# EAGLE design smecstim (EAGLE 5.06)
PIN2: ASD - out; PIN3: BARO - in; PIN4: WGAT - in; PIN5: RFAN - in; PIN6: INJ2 - in
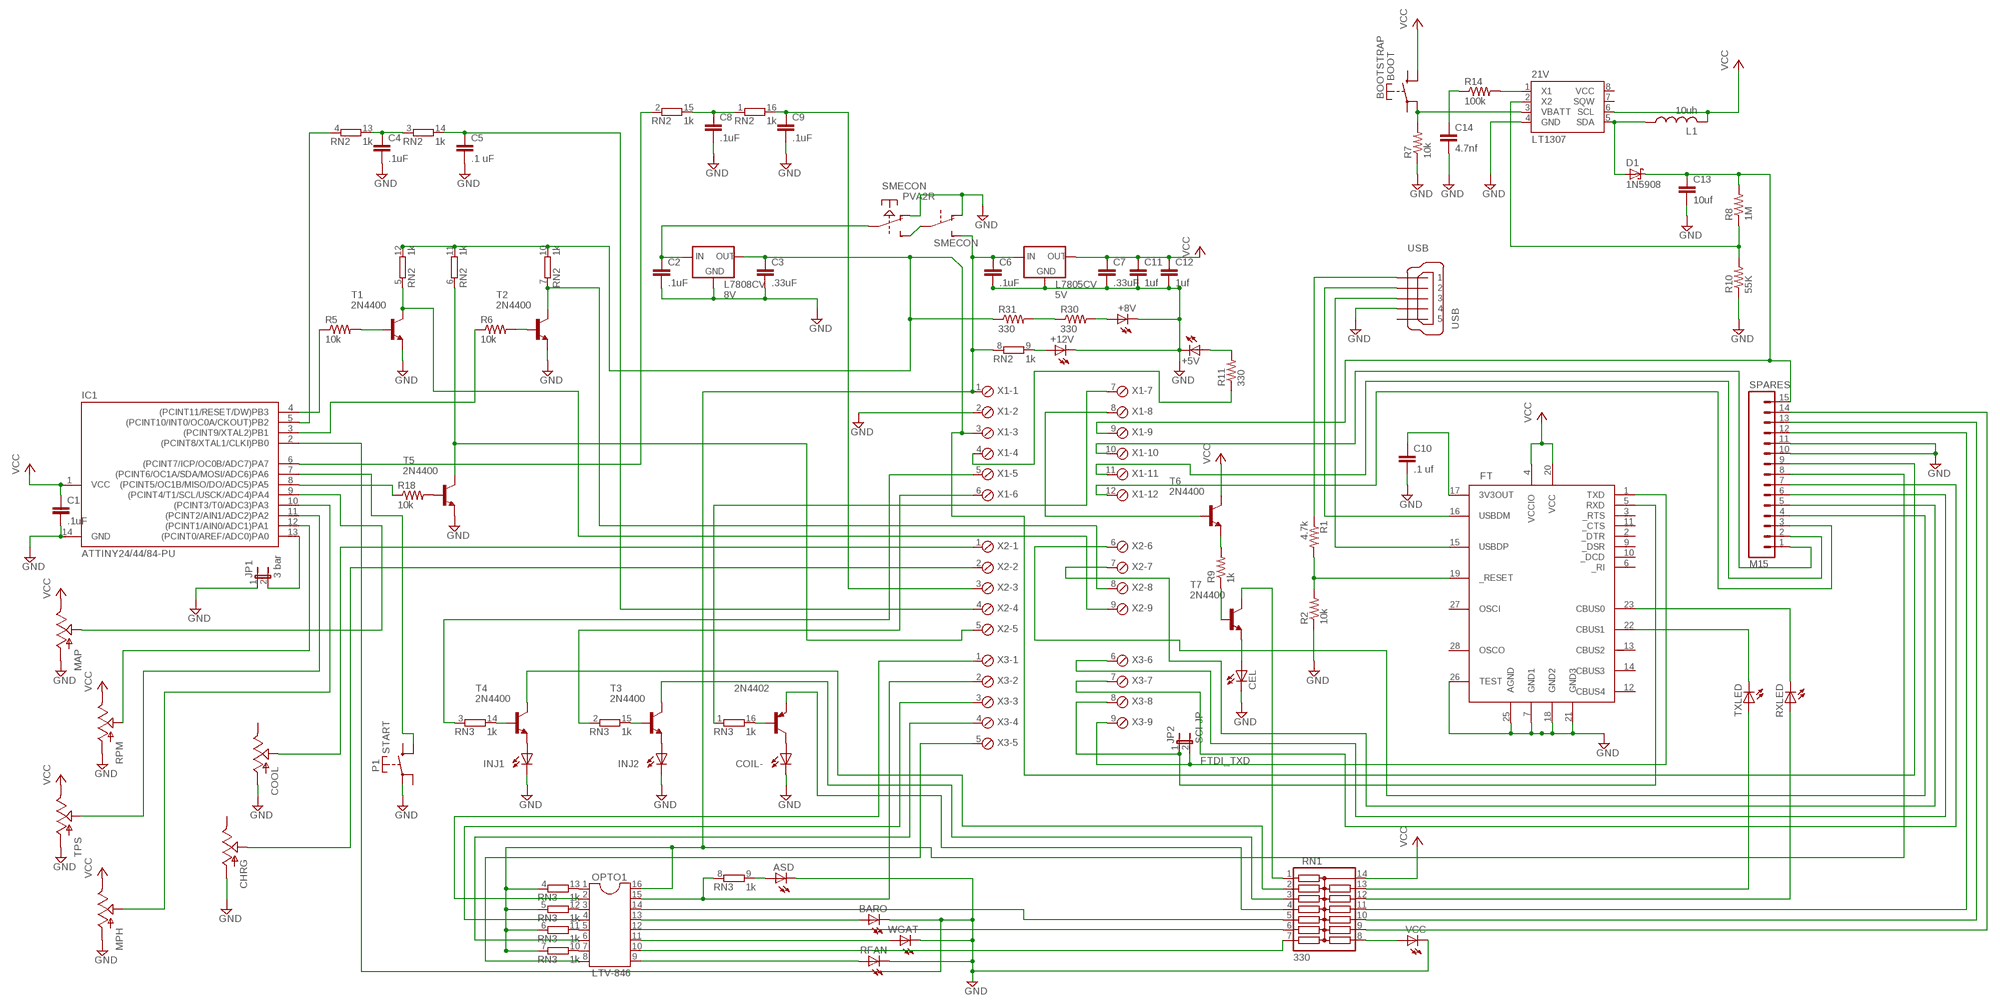
[diagram p0: schematic, sheet 1]

## Parts
2N4402  2N4403-PNP-TO92-EBC  [TO92-EBC]
21V  LT1307  DS1307SO8  [SO08]
+5V  LED5MM  [LED5MM]
+8V  LED5MM  [LED5MM]
+12V  LED5MM  [LED5MM]
ASD  LED5MM  [LED5MM]
BARO  LED5MM  [LED5MM]
BOOTSTRAP  BOOT  FSM4JSMA-SMD  [FSM4JSMA-SMD]
C1  .1uF  C5/2.5  [C5B2.5]
C2  .1uF  C5/2.5  [C5B2.5]
C3  .33uF  C5/2.5  [C5B2.5]
C4  .1uF  C5/2.5  [C5B2.5]
C5  .1 uF  C5/2.5  [C5B2.5]
C6  .1uF  C5/3.5  [C5B3.5]
C7  .33uF  C5/3.5  [C5B3.5]
C8  .1uF  C5/3.5  [C5B3.5]
C9  .1uF  C5/2.5  [C5B2.5]
C10  .1 uf  C5/2.5  [C5B2.5]
C11  1uf  C5/2.5  [C5B2.5]
C12  1uf  C5/2.5  [C5B2.5]
C13  10uf  C5/2.5  [C5B2.5]
C14  4.7nf  C-EU050-030X075  [C050-030X075]
CEL  LED5MM  [LED5MM]
CHRG  CHRG 100K  POT  [ALPS_POT]
COIL-  LED5MM  [LED5MM]
COOL  COOL 100K  POT  [ALPS_POT]
D1  1N5908  [C4111-15]
FT  FT232RL  [SSOP28DB]
IC1  ATTINY24/44/84-PU  [DIL14]
INJ1  LED5MM  [LED5MM]
INJ2  LED5MM  [LED5MM]
JP1  3 bar  JUMPER-2PTH_LOCK  [1X02_LOCK]
JP2  SCI JP  JUMPER-2PTH_LOCK  [1X02_LOCK]
L1  10uh  L-US0207/12  [0207/12]
L7805CV  5V  78XXL  [78XXL]
L7808CV  8V  78XXL  [78XXL]
MAP  MAP 100K  POT  [ALPS_POT]
MPH  MPH 100K  POT  [ALPS_POT]
OPTO1  LTV-846  DIL16S  [SOCKET-16]
P1  START  FSM4JSMA-SMD  [FSM4JSMA-SMD]
R1  4.7k  R-US_0309/12  [0309/12]
R2  10k  R-US_0309/12  [0309/12]
R5  10k  R-US_0309/12  [0309/12]
R6  10k  R-US_0309/12  [0309/12]
R7  10k  R-US_0309/12  [0309/12]
R8  1M  R-US_0309/12  [0309/12]
R9  1k  R-US_0309/12  [0309/12]
R10  55K  R-US_0309/12  [0309/12]
R11  330  R-US_0309/12  [0309/12]
R14  100k  R-US_0309/12  [0309/12]
R18  10k  R-US_0309/12  [0309/12]
R30  330  R-US_0309/12  [0309/12]
R31  330  R-US_0309/12  [0309/12]
RFAN  LED5MM  [LED5MM]
RN1  330  13R  [DIL14]
RN2  1k  8R-P  [DIL16]
RN3  1k  8R-P  [DIL16]
RPM  RPM 100K  POT  [ALPS_POT]
RXLED  LED5MM  [LED5MM]
SMECON  PVA2R  [PVA2R]
SPARES  M15  [1X15]
T1  2N4400  2N4416  [TO92]
T2  2N4400  2N4416  [TO92]
T3  2N4400  2N4416  [TO92]
T4  2N4400  2N4416  [TO92]
T5  2N4400  2N4416  [TO92]
T6  2N4400  2N4416  [TO92]
T7  2N4400  2N4416  [TO92]
TPS  TPS 100K  POT  [ALPS_POT]
TXLED  LED5MM  [LED5MM]
USB  USB  MINI-USB-UX60-MB-5ST  [UX60-MB-5ST]
VCC  LED5MM  [LED5MM]
WGAT  LED5MM  [LED5MM]
X1  MPT12  [12POL254]
X2  MPT9  [9POL254]
X3  MPT9  [9POL254]

## Nets
FTDI_TXD: FT.1(TXD) JP2.2 X3.9
GND: 21V.4(GND) +5V.K(C) +8V.K(C) +12V.K(C) ASD.K(C) BARO.K(C) C1.2 C2.2 C3.2 C4.2 C5.2 C6.2 C7.2 C8.2 C9.2 C10.2 C11.2 C12.2 C13.2 C14.2 CEL.K(C) CHRG.P$3(A) COIL-.K(C) COOL.P$3(A) FT.7(GND1) FT.18(GND2) FT.21(GND3) FT.25(AGND) FT.26(TEST) IC1.2((PCINT8/XTAL1/CLKI)PB0) IC1.14(GND) INJ1.K(C) INJ2.K(C) JP1.1 L7805CV.GND L7808CV.GND MAP.P$3(A) MPH.P$3(A) P1.P$1(P) R2.1 R7.1 R10.1 RFAN.K(C) RPM.P$3(A) SMECON.3(1:O) SMECON.6(2:O) SPARES.10 SPARES.11 T1.3(E) T2.3(E) T5.3(E) TPS.P$3(A) USB.4 VCC.K(C) WGAT.K(C) X1.2
N$1: IC1.10((PCINT3/T0/ADC3)PA3) MPH.P$2(S)
N$2: COOL.P$2(S) X2.1
N$3: OPTO1.2 X3.1
N$4: C3.1 L7808CV.OUT R31.1 RN2.10 RN2.11 RN2.12 SPARES.9 X1.3
N$5: C8.1 RN2.1 RN2.15
N$6: C5.1 RN2.14 X2.4
N$7: CHRG.P$2(S) X2.2
N$8: C9.1 RN2.16 X2.3
N$9: C4.1 RN2.3 RN2.13
N$10: IC1.9((PCINT4/T1/SCL/USCK/ADC4)PA4) MAP.P$2(S)
N$11: IC1.12((PCINT1/AIN0/ADC1)PA1) RPM.P$2(S)
N$12: IC1.11((PCINT2/AIN1/ADC2)PA2) TPS.P$2(S)
N$13: IC1.4((PCINT11/RESET/DW)PB3) R5.1
N$14: IC1.3((PCINT9/XTAL2)PB1) R6.1
N$15: R6.2 T2.2(B)
N$16: R5.2 T1.2(B)
N$17: RN2.5 T1.1(C) X2.9
N$18: RN2.7 T2.1(C) X2.8
N$19: RN3.14 T4.2(B)
N$20: RN3.15 T3.2(B)
N$21: RN1.3 T3.1(C)
N$22: RN1.2 T4.1(C)
N$23: RN3.3 X1.5
N$24: RN3.2 X1.6
N$25: INJ1.A T4.3(E)
N$26: INJ2.A T3.3(E)
N$27: OPTO1.1 RN3.13
N$28: OPTO1.3 RN3.12
N$29: OPTO1.5 RN3.11
N$30: OPTO1.7 RN3.10
N$31: OPTO1.15 RN3.8 X3.2
N$32: 2N4402.B RN3.16
N$33: OPTO1.8 X3.5
N$34: C6.1 L7805CV.IN OPTO1.16 RN2.8 RN3.4 RN3.5 RN3.6 RN3.7 SMECON.4(2:S) SPARES.8 X1.1
N$35: OPTO1.4 X3.3
N$36: OPTO1.6 X3.4
N$37: OPTO1.12 RN1.6
N$38: +5V.A R11.2
N$39: OPTO1.9 RFAN.A
N$40: OPTO1.11 WGAT.A
N$41: ASD.A RN3.9
N$42: OPTO1.10 RN1.7
N$43: BARO.A OPTO1.13
N$44: RN3.1 X1.7
N$45: 2N4402.E RN1.4
N$46: 2N4402.C COIL-.A
N$47: FT.19(_RESET) R1.2 R2.2
N$48: FT.16(USBDM) USB.2
N$49: +12V.A RN2.9
N$50: R30.1 R31.2
N$51: +8V.A R30.2
N$52: R11.1 X1.4
N$53: RN1.1 T7.1(C)
N$54: IC1.5((PCINT10/INT0/OC0A/CKOUT)PB2) RN2.4
N$55: IC1.6((PCINT7/ICP/OC0B/ADC7)PA7) RN2.2
N$56: IC1.8((PCINT5/OC1B/MISO/DO/ADC5)PA5) R18.1
N$57: R18.2 T5.2(B)
N$58: RN2.6 T5.1(C) X2.5
N$59: IC1.7((PCINT6/OC1A/SDA/MOSI/ADC6)PA6) P1.P$4(S)
N$60: IC1.13((PCINT0/AREF/ADC0)PA0) JP1.2
N$61: CEL.A T7.3(E)
N$62: FT.15(USBDP) USB.3
N$63: R1.1 USB.1
N$64: RN1.12 RXLED.A
N$65: C10.1 FT.17(3V3OUT)
N$66: FT.22(CBUS1) TXLED.K(C)
N$67: FT.23(CBUS0) RXLED.K(C)
N$68: RN1.9 SPARES.14
N$69: 21V.5(SDA) D1.A L1.1
N$70: C13.1 D1.C R8.2 SPARES.15 X1.9
N$71: 21V.3(VBATT) BOOTSTRAP.P$2(P) R7.2
N$72: 21V.2(X2) R8.1 R10.2
N$73: 21V.1(X1) R14.2
N$74: C14.1 R14.1
N$75: FT.5(RXD) JP2.1 X3.8
N$76: T6.2(B) X1.8
N$77: R9.2 T6.3(E)
N$78: R9.1 T7.2(B)
N$79: RN1.8 VCC.A
N$80: OPTO1.14 RN1.5
N$81: RN1.13 TXLED.A
N$82: RN1.10 SPARES.13
N$83: RN1.11 SPARES.12
N$84: C2.1 L7808CV.IN SMECON.2(1:P)
N$85: SMECON.1(1:S) SMECON.5(2:P)
SPARE1: SPARES.1 X1.10
SPARE2: SPARES.2 X1.11
SPARE3: SPARES.3 X1.12
SPARE4: SPARES.4 X2.6
SPARE5: SPARES.5 X2.7
SPARE6: SPARES.6 X3.6
SPARE7: SPARES.7 X3.7
VCC: 21V.6(SCL) BOOTSTRAP.P$4(S) C1.1 C7.1 C11.1 C12.1 FT.4(VCCIO) FT.20(VCC) IC1.1(VCC) L1.2 L7805CV.OUT MAP.P$1(E) MPH.P$1(E) RN1.14 RPM.P$1(E) T6.1(C) TPS.P$1(E)
Unconnected: 21V.7(SQW) 21V.8(VCC) BOOTSTRAP.P$1(P) BOOTSTRAP.P$3(S) CHRG.P$1(E) COOL.P$1(E) FT.2(_DTR) FT.3(_RTS) FT.6(_RI) FT.9(_DSR) FT.10(_DCD) FT.11(_CTS) FT.12(CBUS4) FT.13(CBUS2) FT.14(CBUS3) FT.27(OSCI) FT.28(OSCO) P1.P$2(P) P1.P$3(S) USB.5

## Library data of the parts
2N4402 = transistor-neu-to92:*-PNP-: PNP Transistror
21V = SparkFun:DS1307
+5V +8V +12V ASD BARO COIL- INJ1 INJ2 RFAN VCC WGAT = led:LED: LED OSRAM: - CHIPLED LG R971, LG N971, LY N971, LG Q971, LY Q971, LO R971, LY R971 LH N974, LH R974 LS Q976, LO Q976, LY Q976 LO Q996 - Hyper CHIPLED LW Q18S LB Q993, LB Q99A, LB R99A - SideLED LS A670, LO A670, LY A670, LG A670, LP A670 LB A673, LV A673, LT A673, LW A673 LH A674 LY A675 LS A676, LA A676, LO A676, LY A676, LW A676 LS A679, LY A679, LG A679 - Hyper Micro SIDELED® LS Y876, LA Y876, LO Y876, LY Y876 LT Y87S - SmartLED LW L88C, LW L88S LB L89C, LB L89S, LG L890 LS L89K, LO L89K, LY L89K LS L896, LA L896, LO L896, LY L896 - TOPLED LS T670, LO T670, LY T670, LG T670, LP T670 LSG T670, LSP T670, LSY T670, LOP T670, LYG T670 LG T671, LOG T671, LSG T671 LB T673, LV T673, LT T673, LW T673 LH T674 LS T676, LA T676, LO T676, LY T676, LB T676, LH T676, LSB T676, LW T676 LB T67C, LV T67C, LT T67C, LS T67K, LO T67K, LY T67K, LW E67C LS E67B, LA E67B, LO E67B, LY E67B, LB E67C, LV E67C, LT E67C LW T67C LS T679, LY T679, LG T679 LS T770, LO T770, LY T770, LG T770, LP T770 LB T773, LV T773, LT T773, LW T773 LH T774 LS E675, LA E675, LY E675, LS T675 LS T776, LA T776, LO T776, LY T776, LB T776 LHGB T686 LT T68C, LB T68C - Hyper Mini TOPLED® LB M676 - Mini TOPLED Santana® LG M470 LS M47K, LO M47K, LY M47K Source: http://www.osram.convergy.de LUXEON: - LUMILED® LXK2-PW12-R00, LXK2-PW12-S00, LXK2-PW14-U00, LXK2-PW14-V00 LXK2-PM12-R00, LXK2-PM12-S00, LXK2-PM14-U00 LXK2-PE12-Q00, LXK2-PE12-R00, LXK2-PE12-S00, LXK2-PE14-T00, LXK2-PE14-U00 LXK2-PB12-K00, LXK2-PB12-L00, LXK2-PB12-M00, LXK2-PB14-N00, LXK2-PB14-P00, LXK2-PB14-Q00 LXK2-PR12-L00, LXK2-PR12-M00, LXK2-PR14-Q00, LXK2-PR14-R00 LXK2-PD12-Q00, LXK2-PD12-R00, LXK2-PD12-S00 LXK2-PH12-R00, LXK2-PH12-S00 LXK2-PL12-P00, LXK2-PL12-Q00, LXK2-PL12-R00 Source: www.luxeon.com KINGBRIGHT: KA-3528ASYC Source: www.kingbright.com
BOOTSTRAP P1 = switch-misc:FSM4JSMA-SMD: TYCO SWITCH
C1-C13 = capacitor-wima:C: CAPACITOR naming: grid - package width
C14 = rcl:C-EU: CAPACITOR, European symbol
CEL RXLED TXLED = SparkFun:LED: LEDs Standard schematic elements and footprints for 5mm, 3mm, 1206, and 0603 sized LEDs. 5mm - Spark Fun Electronics SKU : COM-00529 (and others)
CHRG COOL MAP MPH RPM TPS = SparkFun:POT
D1 = diode:1N5908: DIODE schottky
FT = ftdichip:FT232RL: USB UART 4th Generation USB UART (USB <-> Serial) Controller
IC1 = attiny24_44_84:ATTINY24/44/84
JP1 JP2 = SparkFun:JUMPER-2: Jumper Basic 0.1" spaced jumper. Use with breakaway headers.
L1 = resistor:L-US: INDUCTOR, American symbol
L7805CV L7808CV = v-reg:78XXL: VOLTAGE REGULATOR
OPTO1 = ic-package:DIL16: Dual In Line / Socket
R1 R2 R7-R11 R14 = rcl:R-US_: RESISTOR, American symbol
R5 R6 R18 R30 R31 = resistor:R-US_: RESISTOR, American symbol
RN1 = resistor-dil:13R: DIL RESISTOR
RN2 RN3 = resistor-dil:8R-P: DIL RESISTOR
SMECON = switch-misc:PVA2R: ITT SWITCH
SPARES = SparkFun:M15: Header 15 Standard 15-pin 0.1" header. Use with straight break away headers (SKU : PRT-00116), right angle break away headers (PRT-00553), swiss pins (PRT-00743), machine pins (PRT-00117), and female headers (PRT-00115).
T1-T4 T6 T7 = transistor:2N4416: NPN TRANSISTOR
T5 = transistor-neu-to92:2N4416: NPN TRANSISTOR
USB = con-hirose:MINI-USB-: MINI USB Connector Source: http://www.hirose.co.jp/cataloge_hp/e24000019.pdf
X1 = con-phoenix-254:MPT12: PHOENIX CONNECTOR
X2 X3 = con-phoenix-254:MPT9: PHOENIX CONNECTOR

## Board
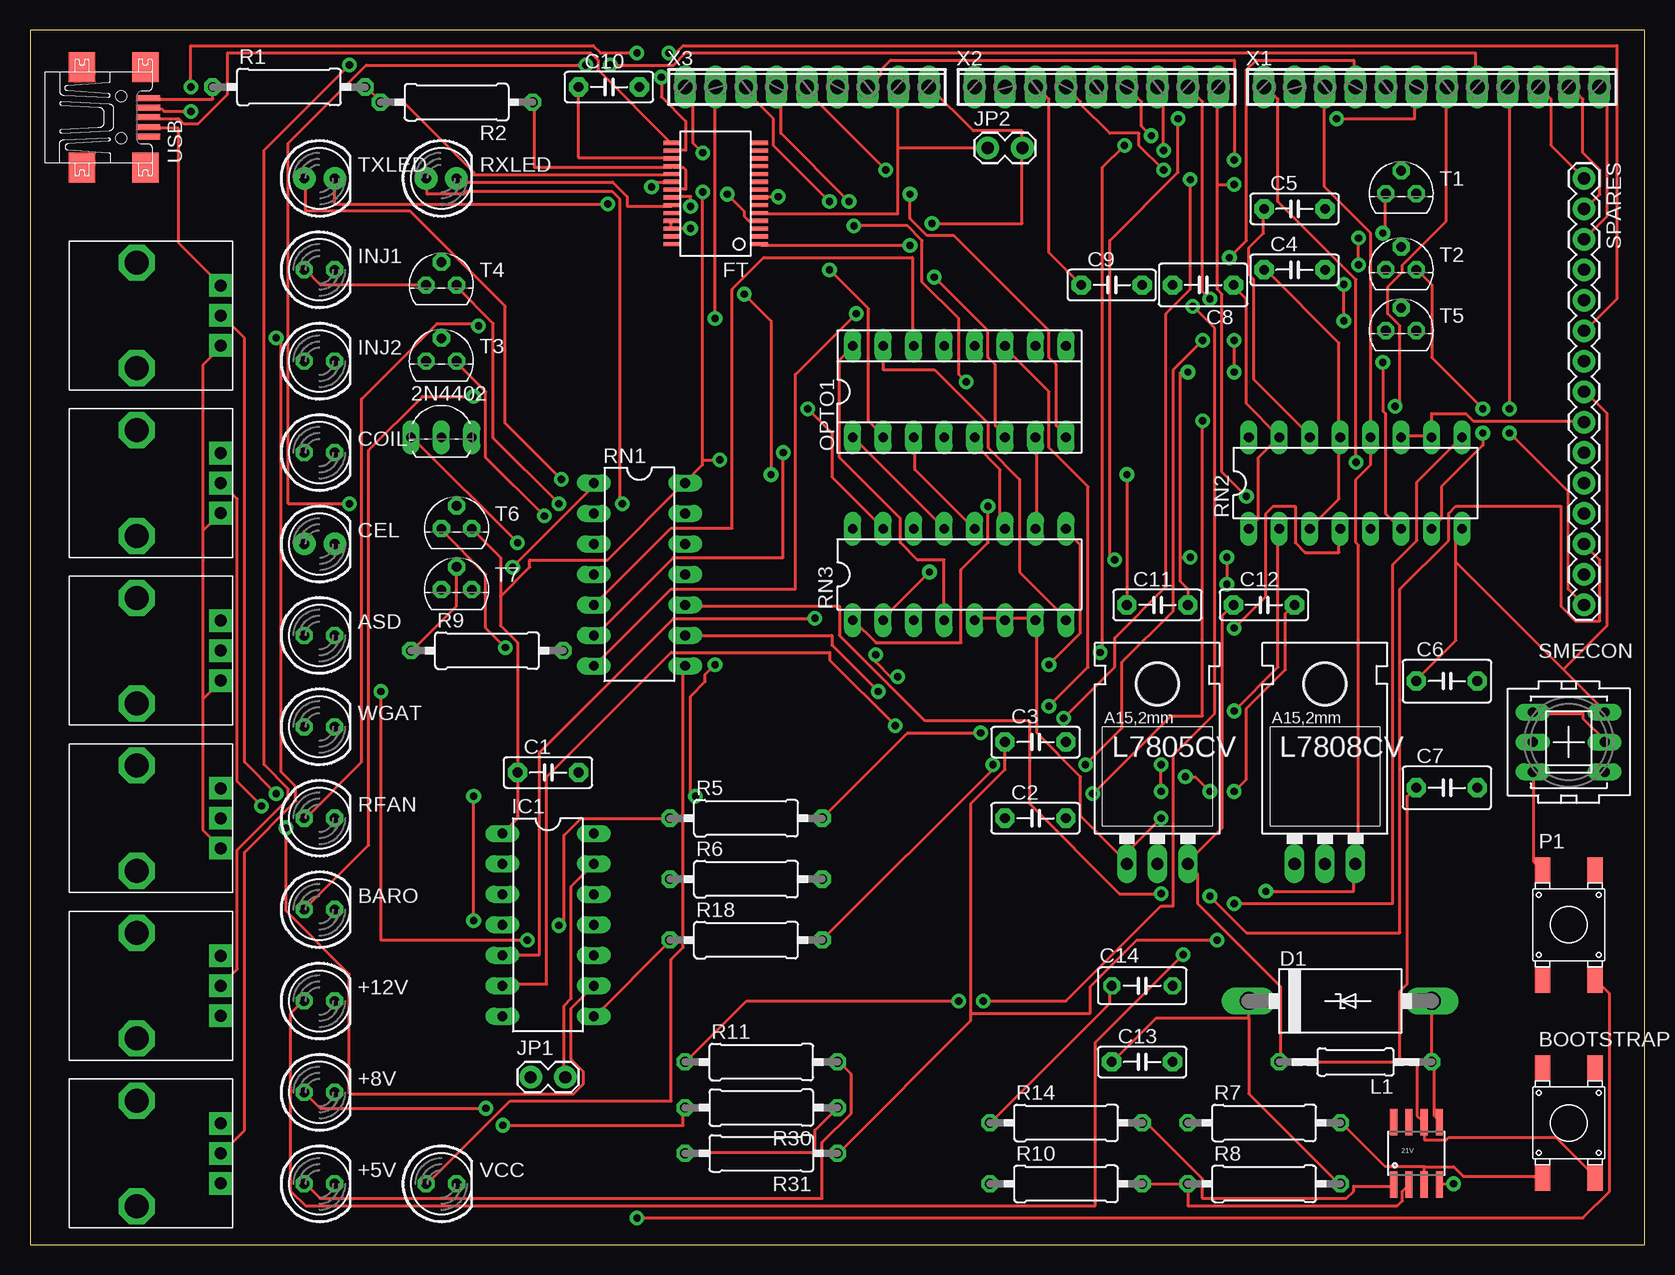
[diagram p1: board, top side]
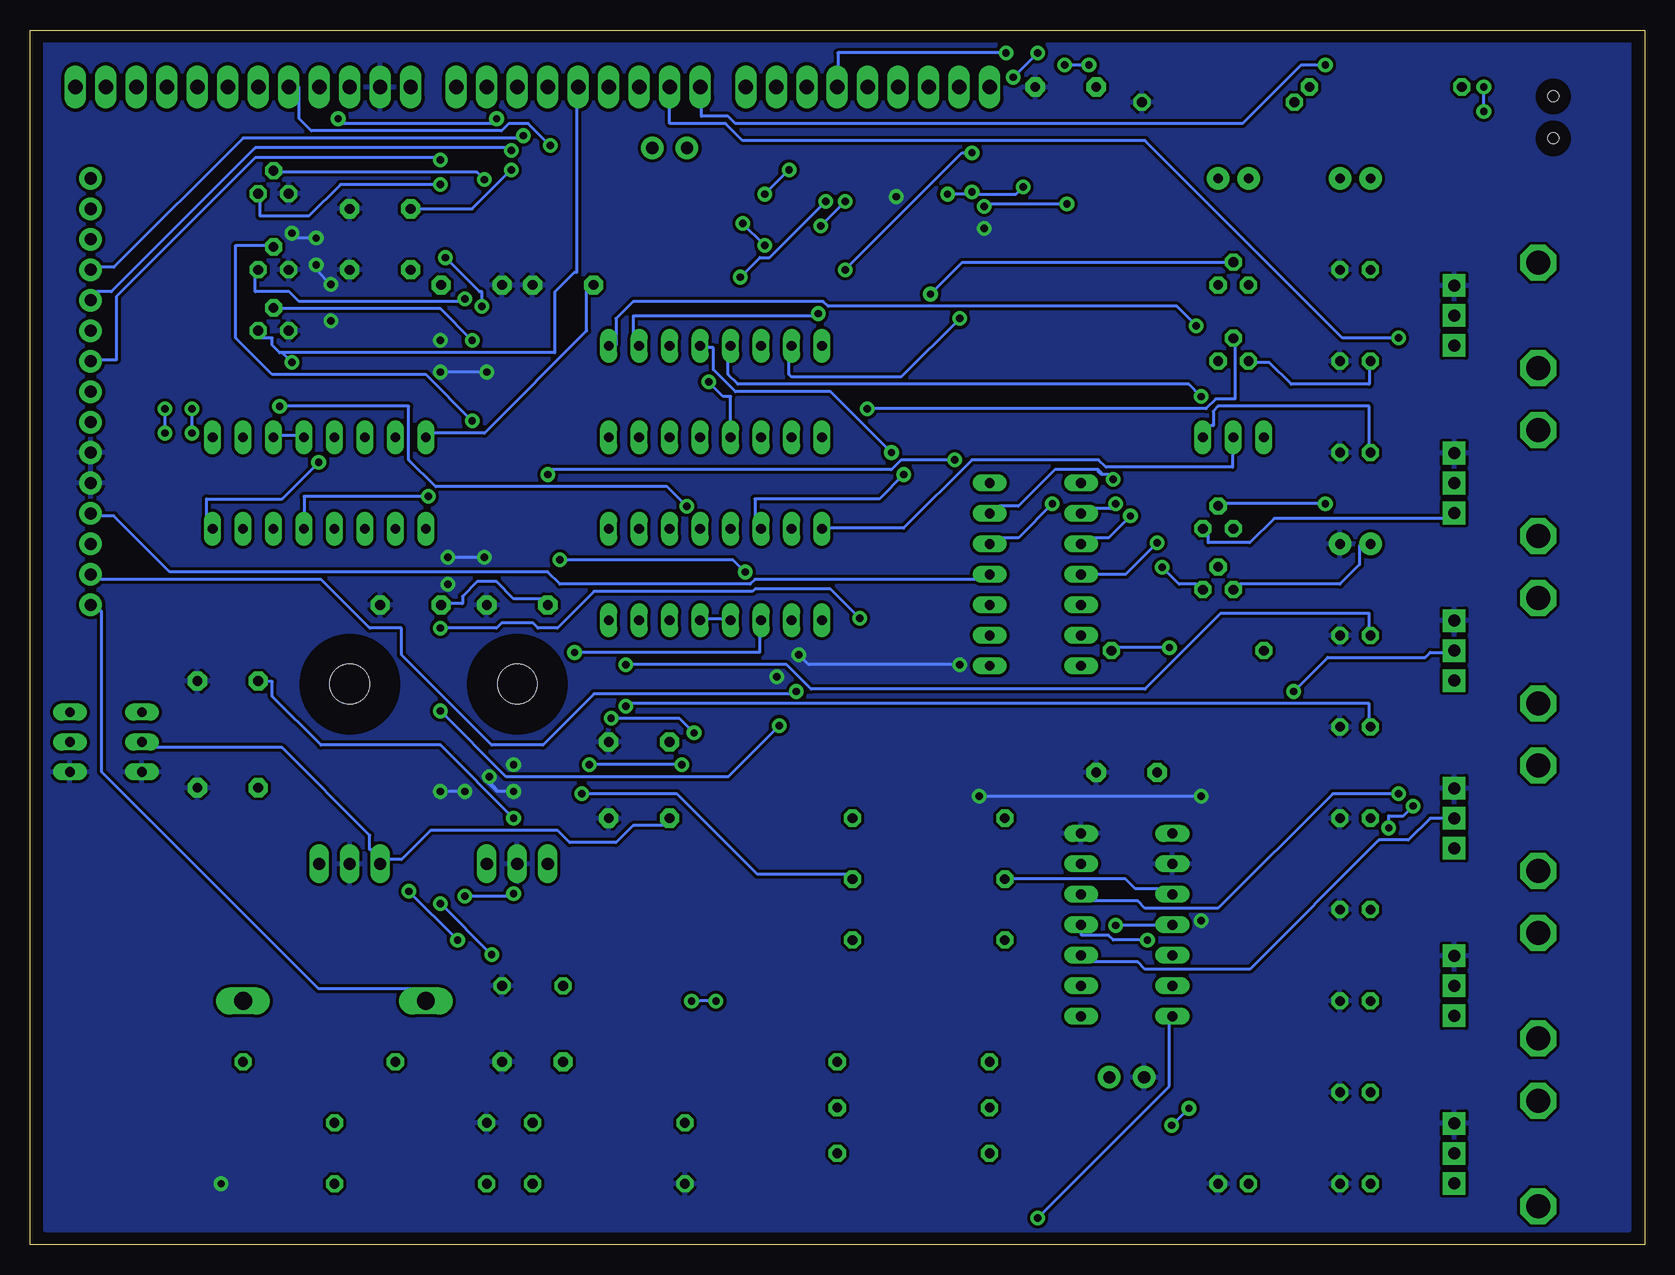
[diagram p2: board, bottom side, seen from below]

Size 134.6 x 101.27 mm. Coordinates in mm from the lower left corner, seen from the top.
Outline: 0,0 134.6,0 134.6,101.27 0,101.27 0,0
Copper layers (1*16): Top 0.035mm / dielectric 1.5mm / Bottom 0.035mm
Design rules "default *": minimum track width 10mil, minimum drill 24mil, track to track 10mil, track to pad 10mil, pad to pad 10mil, via to via 10mil, smd to smd 10mil, copper to edge 40mil, drill to drill 10mil, minimum pad ring 12mil, minimum via ring 12mil, stop-mask expansion 4mil, vias tented up to drill 0mil, thermal gap 10mil

### Footprints (pad centres in the part's own frame; a part is rotated, then mirrored left to right if it is on the bottom)
TO92-EBC = drill 0.813 long: B 0,-1.27; C 2.54,-1.27; E -2.54,-1.27
SO08 = smd 0.61 x 2.21: 1 -1.905,-2.616; 2 -0.635,-2.616; 3 0.635,-2.616; 4 1.905,-2.616; 5 1.905,2.616; 6 0.635,2.616; 7 -0.635,2.616; 8 -1.905,2.616
LED5MM = drill 0.813 octagon: A -1.27,0; K 1.27,0
FSM4JSMA-SMD = smd 1.3 x 2.1: P$1 -2.196,4.584; P$2 -2.196,-4.6; P$3 2.204,4.584; P$4 2.204,-4.6
C5B2.5 = drill 0.813 pad 1.6 octagon: 1 -2.54,0; 2 2.54,0
C5B3.5 = drill 0.813 pad 1.6 octagon: 1 -2.54,0; 2 2.54,0
C050-030X075 = drill 0.813 octagon: 1 -2.54,0; 2 2.54,0
LED5MM' = drill 0.813 pad 1.88 round: A -1.27,0; K 1.27,0
ALPS_POT = drill 1 pad 1.88 square: P$1 7,-2.5; P$2 7,0; P$3 7,2.5 | drill 2 octagon: P$4 0,-4.4; P$5 0,4.4
C4111-15 = drill 1.499 long: A 7.62,0; C -7.62,0
SSOP28DB = smd 0.348 x 1.397: 1 -4.225,-3.656; 2 -3.575,-3.656; 3 -2.925,-3.656; 4 -2.275,-3.656; 5 -1.625,-3.656; 6 -0.975,-3.656; 7 -0.325,-3.656; 8 0.325,-3.656; 9 0.975,-3.656; 10 1.625,-3.656; 11 2.275,-3.656; 12 2.925,-3.656; 13 3.575,-3.656; 14 4.225,-3.656; 15 4.225,3.656; 16 3.575,3.656; 17 2.925,3.656; 18 2.275,3.656; 19 1.625,3.656; 20 0.975,3.656; 21 0.325,3.656; 22 -0.325,3.656; 23 -0.975,3.656; 24 -1.625,3.656; 25 -2.275,3.656; 26 -2.925,3.656; 27 -3.575,3.656; 28 -4.225,3.656
DIL14 = drill 0.813 long: 1 -7.62,-3.81; 2 -5.08,-3.81; 3 -2.54,-3.81; 4 0,-3.81; 5 2.54,-3.81; 6 5.08,-3.81; 7 7.62,-3.81; 8 7.62,3.81; 9 5.08,3.81; 10 2.54,3.81; 11 0,3.81; 12 -2.54,3.81; 13 -5.08,3.81; 14 -7.62,3.81
1X02_LOCK = drill 1.016 pad 1.88 round: 1 -0.178,0; 2 2.718,0
0207/12 = drill 0.813 octagon: 1 -6.35,0; 2 6.35,0
78XXL = drill 1.016 long: GND 0,-3.81; IN -2.54,-3.81; OUT 2.54,-3.81 | hole 3.302: 0,11.176
SOCKET-16 = drill 0.813 long: 1 -8.89,-3.81; 2 -6.35,-3.81; 3 -3.81,-3.81; 4 -1.27,-3.81; 5 1.27,-3.81; 6 3.81,-3.81; 7 6.35,-3.81; 8 8.89,-3.81; 9 8.89,3.81; 10 6.35,3.81; 11 3.81,3.81; 12 1.27,3.81; 13 -1.27,3.81; 14 -3.81,3.81; 15 -6.35,3.81; 16 -8.89,3.81
0309/12 = drill 0.813 octagon: 1 -6.35,0; 2 6.35,0
DIL16 = drill 0.813 long: 1 -8.89,-3.81; 2 -6.35,-3.81; 3 -3.81,-3.81; 4 -1.27,-3.81; 5 1.27,-3.81; 6 3.81,-3.81; 7 6.35,-3.81; 8 8.89,-3.81; 9 8.89,3.81; 10 6.35,3.81; 11 3.81,3.81; 12 1.27,3.81; 13 -1.27,3.81; 14 -3.81,3.81; 15 -6.35,3.81; 16 -8.89,3.81
PVA2R = drill 0.813 long: 1 -2.997,2.489; 2 -2.997,0; 3 -2.997,-2.489; 4 2.997,2.489; 5 2.997,0; 6 2.997,-2.489
1X15 = drill 1.016 pad 1.88 round: 1 0,0; 2 2.54,0; 3 5.08,0; 4 7.62,0; 5 10.16,0; 6 12.7,0; 7 15.24,0; 8 17.78,0; 9 20.32,0; 10 22.86,0; 11 25.4,0; 12 27.94,0; 13 30.48,0; 14 33.02,0; 15 35.56,0
TO92 = drill 0.813 octagon: 1 1.27,0; 2 0,1.905; 3 -1.27,0
UX60-MB-5ST = smd 2 x 0.5: 1 2.25,1.6; 2 2.25,0.8; 3 2.25,0; 4 2.25,-0.8; 5 2.25,-1.6 | smd 2.2 x 2.5: M1 -3.3,-4.2; M2 -3.3,4.2; M3 2,4.2; M4 2,-4.2 | hole 0.9: 0,-1.75; 0,1.75
12POL254 = drill 1.2 long: 1 -13.97,0; 2 -11.43,0; 3 -8.89,0; 4 -6.35,0; 5 -3.81,0; 6 -1.27,0; 7 1.27,0; 8 3.81,0; 9 6.35,0; 10 8.89,0; 11 11.43,0; 12 13.97,0
9POL254 = drill 1.2 long: 1 -10.16,0; 2 -7.62,0; 3 -5.08,0; 4 -2.54,0; 5 0,0; 6 2.54,0; 7 5.08,0; 8 7.62,0; 9 10.16,0

### Placement (x,y rotation side)
2N4402  34.29,68.58 0 top
21V  115.57,7.62 0 top
+5V  24.13,5.08 0 top
+8V  24.13,12.7 0 top
+12V  24.13,20.32 0 top
ASD  24.13,50.8 0 top
BARO  24.13,27.94 0 top
BOOTSTRAP  128.27,10.16 0 top
C1  43.18,39.37 0 top
C2  83.82,35.56 0 top
C3  83.82,41.91 0 top
C4  105.41,81.28 0 top
C5  105.41,86.36 0 top
C6  118.11,46.99 0 top
C7  118.11,38.1 0 top
C8  97.79,80.01 180 top
C9  90.17,80.01 0 top
C10  48.26,96.52 0 top
C11  93.98,53.34 0 top
C12  102.87,53.34 0 top
C13  92.71,15.24 0 top
C14  92.71,21.59 0 top
CEL  [LED5MM']  24.13,58.42 0 top
CHRG  8.89,7.62 0 top
COIL-  24.13,66.04 0 top
COOL  8.89,21.59 0 top
D1  109.22,20.32 0 top
FT  57.15,87.63 90 top
IC1  43.18,26.67 270 top
INJ1  24.13,81.28 0 top
INJ2  24.13,73.66 0 top
JP1  41.91,13.97 0 top
JP2  80.01,91.44 0 top
L1  110.49,15.24 180 top
L7805CV  93.98,35.56 0 top
L7808CV  107.95,35.56 0 top
MAP  8.89,63.5 0 top
MPH  8.89,35.56 0 top
OPTO1  77.47,71.12 0 top
P1  128.27,26.67 0 top
R1  21.59,96.52 0 top
R2  35.56,95.25 180 top
R5  59.69,35.56 0 top
R6  59.69,30.48 0 top
R7  102.87,10.16 0 top
R8  102.87,5.08 0 top
R9  38.1,49.53 0 top
R10  86.36,5.08 0 top
R11  60.96,15.24 0 top
R14  86.36,10.16 0 top
R18  59.69,25.4 0 top
R30  60.96,11.43 180 top
R31  60.96,7.62 180 top
RFAN  24.13,35.56 0 top
RN1  50.8,55.88 270 top
RN2  110.49,63.5 0 top
RN3  77.47,55.88 0 top
RPM  8.89,77.47 0 top
RXLED  [LED5MM']  34.29,88.9 0 top
SMECON  128.27,41.91 0 top
SPARES  129.54,88.9 270 top
T1  114.3,87.63 0 top
T2  114.3,81.28 0 top
T3  34.29,73.66 0 top
T4  34.29,80.01 0 top
T5  114.3,76.2 0 top
T6  35.56,59.69 0 top
T7  35.56,54.61 0 top
TPS  8.89,49.53 0 top
TXLED  [LED5MM']  24.13,88.9 0 top
USB  7.62,93.98 0 top
VCC  34.29,5.08 0 top
WGAT  24.13,43.18 0 top
X1  116.84,96.52 0 top
X2  88.9,96.52 0 top
X3  64.77,96.52 0 top

### Tracks (layer width: path | path; a pad name or v marks a point on that pad's centre or on a via)
FTDI_TXD  (via drill 0.61)
  Top 0.254: v73.36,83.31 60.96,83.31 FT.1 | v75.18,85.14 82.7,85.14 82.7,91.44 | 82.7,91.44 82.7,92.86 78.64,92.86 74.98,96.52 X3.9 | 82.7,91.44 JP2.2
  Bottom 0.254: v73.36,83.31 v75.18,85.14
GND  (via drill 0.61)
  Top 0.254: FT.21 53.65,87.99 54.66,87.99 54.66,89.61 54.46,89.81 53.65,89.81 FT.18 53.44,89.81 42.06,89.81 42.06,95.1 R2.1 | FT.25 53.44,85.34 53.44,84.73 FT.26 53.65,84.73 v55.07,84.73 | v62.38,87.38 60.96,87.38 FT.7 | USB.4 9.96,93.07 12.39,93.07 12.39,83.52 15.85,80.06 RPM.P$3 | P1.P$1 125.98,31.29 125.37,31.9 125.37,39.42 SMECON.3 | v118.67,5.08 117.65,5.08 21V.4 | v112.78,84.33 112.78,84.53 112.98,84.73 112.98,87.58 T1.3 | v110.74,81.69 v110.74,83.92 | v109.53,77.01 v109.53,80.06 | v100.38,72.75 v100.38,75.39 | v96.52,72.75 95.91,72.75 95.91,57.3 | 95.91,57.3 95.91,55.27 96.52,54.66 C11.2 | 95.91,57.3 v96.72,57.3 | v99.77,57.3 v99.77,55.07 | v100.38,37.8 101.4,38.81 101.4,44.7 104.65,47.95 104.65,52.63 105.26,53.24 C12.2 | v98.35,37.8 97.13,39.01 v96.32,39.01 | v94.28,37.8 v94.28,40.03 | v72.34,47.35 71.73,47.35 70.51,48.56 v70.51,49.17 | v57.1,48.36 56.29,47.55 56.29,46.94 55.07,45.72 55.07,37.8 v55.47,37.39 | v36.98,27.03 v36.98,37.39
  Bottom 0.254: v112.78,84.33 112.37,83.92 v110.74,83.92 | v110.74,81.69 110.74,81.28 v109.53,80.06 | v96.52,72.75 v100.38,72.75 | v96.72,57.3 v99.77,57.3 | v98.35,37.8 v100.38,37.8 | v96.32,39.01 96.32,38.41 96.11,38.41 96.11,38.2 95.91,38.2 95.91,38 95.71,38 95.71,37.8 v94.28,37.8 | v70.51,49.17 69.7,48.36 v57.1,48.36 | v36.98,37.39 v55.47,37.39
  pour Bottom: 1.27,100.33 133.35,100.33 133.35,1.27 1.27,1.27
N$1
  Bottom 0.254: IC1.10 46.94,23.98 46.53,23.57 42.27,23.57 41.66,22.96 32.92,22.96 22.15,33.73 19.71,33.73 17.88,35.56 MPH.P$2
N$2  (via drill 0.61)
  Top 0.254: v26.62,98.35 19.51,91.24 19.51,40.03 21.54,38 21.54,37.19 17.27,32.92 17.27,22.96 16.05,21.74 COOL.P$2
  Bottom 0.254: v26.62,98.35 28.65,98.35 33.53,93.47 75.79,93.47 76.4,94.08 78.64,94.08 78.64,96.52 X2.1
N$3  (via drill 0.61)
  Top 0.254: v66.65,81.28 69.9,78.03 69.9,68.68 71.12,67.46 OPTO1.2 | v56.08,91.03 55.27,91.85 55.27,95.91 54.66,96.52 X3.1
  Bottom 0.254: v66.65,81.28 56.9,91.03 v56.08,91.03
N$4  (via drill 0.61)
  Top 0.254: 78.44,19.3 78.44,36.78 81.28,39.62 C3.1 | 78.44,19.3 78.44,18.69 67.46,7.72 R31.1 | 116.84,67.46 114.4,67.46 RN2.11 | X1.3 107.9,96.52 107.9,88.19 111.76,84.33 RN2.12 111.76,65.02 110.54,63.8 110.54,58.52 110.74,58.32 110.74,32.11 110.54,31.9 L7808CV.OUT 110.34,31.7 110.34,29.46 v103.02,29.46 | 116.84,67.46 116.84,69.29 119.69,69.29 120.29,68.68 129.44,68.68 SPARES.9 | 116.84,67.46 RN2.10 | 78.44,19.3 88.39,19.3 88.39,21.54 92.25,25.4 v98.96,25.4
  Bottom 0.254: RN2.12 111.76,67.46 114.2,67.46 RN2.11 | v98.96,25.4 v103.02,29.46
N$5
  Top 0.254: RN2.1 101.6,59.74 102.41,60.55 102.41,65.63 104.04,67.26 RN2.15 104.04,67.46 101.4,70.1 101.4,78.84 100.38,79.86 C8.1
N$6  (via drill 0.61)
  Top 0.254: RN2.14 106.68,67.46 102.01,72.14 102.01,80.47 101.6,80.87 101.6,83.11 102.82,84.33 102.82,86.36 C5.1 | X2.4 87.58,95.3 87.58,95.1 90.02,92.66 92.46,92.66 92.46,91.64 v94.49,89.61
  Bottom 0.254: v94.49,89.61 97.74,86.36 C5.1
N$7  (via drill 0.61)
  Top 0.254: v20.52,75.59 20.93,75.18 20.93,39.42 22.15,38.2 22.15,36.98 17.88,32.72 17.88,9.55 16.05,7.72 CHRG.P$2
  Bottom 0.254: X2.2 81.28,93.47 76.61,93.47 75.18,92.05 41.66,92.05 25.2,75.59 v20.52,75.59
N$8
  Top 0.254: X2.3 83.92,96.52 84.94,95.5 84.94,82.7 C9.1
  Bottom 0.254: RN2.16 101.6,67.46 101.4,67.67 96.72,67.67 88.19,76.2 88.19,79.86 87.78,79.86 C9.1
N$9
  Top 0.254: RN2.3 106.68,59.74 109.12,62.18 109.12,67.26 RN2.13 109.12,67.46 109.12,75.18 103.02,81.28 C4.1
N$10  (via drill 0.61)
  Top 0.254: v21.34,34.75 21.34,27.84 26.62,22.55 26.62,12.6 45.31,12.6 46.13,13.41 46.13,14.43 45.11,15.44 45.11,19.71 IC1.9 | v19.3,36.58 17.27,38.61 17.27,62.18 16.05,63.4 MAP.P$2
  Bottom 0.254: v21.34,34.75 21.34,35.76 20.12,35.76 v19.3,36.58
N$11  (via drill 0.61)
  Top 0.254: v20.52,37.59 17.88,40.23 17.88,75.59 16.05,77.42 RPM.P$2
  Bottom 0.254: v20.52,37.59 26.01,37.59 35.56,28.04 41.66,28.04 42.27,28.65 46.53,28.65 46.94,29.06 IC1.12
N$12  (via drill 0.61)
  Top 0.254: v41.45,25.4 29.26,25.4 v29.26,46.13
  Bottom 0.254: v41.45,25.4 44.3,25.4 44.7,25.81 46.94,25.81 46.94,26.62 IC1.11 | v29.26,46.13 26.42,48.97 18.29,48.97 17.88,49.38 16.05,49.38 TPS.P$2
N$13  (via drill 0.61)
  Top 0.254: v44.09,26.62 44.5,27.03 44.5,34.14 45.92,35.56 R5.1
  Bottom 0.254: v44.09,26.62 39.42,26.62 IC1.4
N$14
  Bottom 0.254: IC1.3 39.83,29.67 42.47,29.67 43.28,30.48 R6.1
N$15  (via drill 0.61)
  Top 0.254: v88.59,37.59 95.1,44.09 97.74,44.09 v97.74,68.68
  Bottom 0.254: R6.2 66.45,30.89 73.97,30.89 80.67,37.59 v88.59,37.59 | v97.74,68.68 101.6,72.54 114.4,72.54 117.45,75.59 117.45,83.31 114.4,83.31 T2.2
N$16  (via drill 0.61)
  Top 0.254: R5.2 73.15,42.67 v79.25,42.67 | v86.16,43.89 90.42,48.16 90.42,50.6 94.69,54.86 94.69,77.62 96.72,79.65 v96.72,88.8
  Bottom 0.254: v79.25,42.67 80.47,43.89 v86.16,43.89 | v96.72,88.8 97.33,89.41 114.2,89.41 T1.2
N$17  (via drill 0.61)
  Top 0.254: v101.4,62.38 99.36,64.41 99.36,79.25 98.96,79.65 98.96,88.39 | 98.96,88.39 98.96,96.52 X2.9 | 98.96,88.39 v100.38,88.39
  Bottom 0.254: v101.4,62.38 111.76,62.38 RN2.5 | v100.38,88.39 108.71,88.39 111.35,85.75 115.42,85.75 115.42,87.58 T1.1
N$18  (via drill 0.61)
  Top 0.254: v121.11,67.67 121.11,66.65 117.65,63.2 117.65,60.55 116.84,59.74 RN2.7 | v121.11,69.7 116.84,73.97 116.84,80.06 115.62,81.28 T2.1 | X2.8 97.74,95.3 97.74,79.45 v98.35,78.84
  Bottom 0.254: v121.11,69.7 v121.11,67.67 | v98.35,78.84 98.55,78.64 112.17,78.64 112.98,79.45 115.82,79.45 115.82,81.28 T2.1
N$19  (via drill 0.61)
  Top 0.254: v59.54,79.25 61.77,77.01 v61.77,64.21
  Bottom 0.254: v59.54,79.25 56.9,81.89 34.34,81.89 T4.2 | v61.77,64.21 63.8,62.18 74.17,62.18 74.17,59.74 73.76,59.74 RN3.14
N$20  (via drill 0.61)
  Top 0.254: v64.82,69.7 66.85,67.67 66.85,64.01 71.12,59.74 RN3.15
  Bottom 0.254: v64.82,69.7 36.58,69.7 35.76,70.51 34.14,70.51 34.14,75.39 T3.2
N$21  (via drill 0.61)
  Top 0.254: v42.88,60.76 38,65.63 38,71.12 35.56,73.56 T3.1
  Bottom 0.254: v42.88,60.76 44.7,58.93 46.53,58.93 46.94,58.52 RN1.3
N$22  (via drill 0.61)
  Top 0.254: v44.09,61.77 38.61,67.26 38.61,76.81 35.56,79.86 T4.1
  Bottom 0.254: v44.09,61.77 44.5,61.37 46.53,61.37 46.94,60.96 RN1.2
N$23  (via drill 0.61)
  Top 0.254: v89.2,49.38 89.41,49.58 89.41,89.81 v91.24,91.64
  Bottom 0.254: v89.2,49.38 73.76,49.38 73.76,52.02 RN3.3 | v91.24,91.64 93.07,93.47 94.69,93.47 95.3,92.86 111.15,92.86 112.17,93.88 112.17,96.52 X1.5
N$24  (via drill 0.61)
  Top 0.254: v74.98,56.08 71.12,52.22 RN3.2 | v90.42,57.1 90.02,57.51 90.02,83.72 95.71,89.41 v95.71,93.88 | v108.92,93.88 115.42,93.88 115.42,96.52 X1.6
  Bottom 0.254: v74.98,56.08 76,57.1 v90.42,57.1 | v95.71,93.88 96.11,93.47 108.51,93.47 v108.92,93.88
N$25
  Top 0.254: INJ1.A 22.96,81.28 24.18,80.06 32.92,80.06 T4.3
N$26
  Bottom 0.254: INJ2.A 22.96,73.56 22.96,71.73 29.46,71.73 31.29,73.56 32.92,73.56 T3.3
N$27
  Top 0.254: RN3.13 76.2,59.74 68.68,67.26 OPTO1.1
N$28
  Top 0.254: RN3.12 78.64,59.74 73.76,64.62 73.76,67.26 OPTO1.3
N$29
  Top 0.254: RN3.11 81.28,59.74 80.87,60.15 80.87,64.62 78.84,66.65 78.84,67.26 OPTO1.5
N$30
  Top 0.254: RN3.10 83.92,59.74 83.92,67.26 OPTO1.7
N$31  (via drill 0.61)
  Top 0.254: RN3.8 86.36,52.22 82.5,56.08 82.5,63.8 79.86,66.45 79.86,68.48 75.39,72.95 71.12,72.95 OPTO1.15 | v57.1,77.22 57.1,96.52 X3.2
  Bottom 0.254: v57.1,77.22 61.98,72.34 71.12,72.34 71.32,72.54 71.32,74.78 71.12,74.78 OPTO1.15
N$32
  Bottom 0.254: 2N4402.B 34.34,67.26 34.34,64.82 44.91,64.82 45.52,65.43 56.08,65.43 61.77,59.74 68.48,59.74 RN3.16
N$33  (via drill 0.61)
  Top 0.254: v73.36,87.58 73.36,85.55 74.78,84.12 77.01,84.12 84.94,76.2 84.94,73.97 85.55,73.36 85.55,68.28 86.36,67.46 OPTO1.8 | v71.32,89.61 64.82,96.11 64.82,96.52 X3.5
  Bottom 0.254: v73.36,87.58 v71.32,89.61
N$34  (via drill 0.61)
  Top 0.254: 81.28,52.22 78.84,52.22 RN3.5 | 81.28,52.22 83.72,52.22 RN3.7 83.92,52.02 83.92,42.67 87.58,39.01 87.58,35.76 91.03,32.31 | 81.28,52.22 RN3.6 | OPTO1.16 68.48,74.78 67.46,73.76 67.46,65.63 72.54,60.55 72.54,58.52 73.97,57.1 76.2,57.1 RN3.4 | 91.03,32.31 91.44,31.9 L7805CV.IN 91.03,32.31 | 118.87,56.9 118.87,50.39 115.62,47.14 C6.1 | 118.87,56.9 118.87,59.13 119.28,59.54 RN2.8 | 118.87,56.9 127.81,47.95 | 127.81,47.95 131.27,44.5 SMECON.4 | v110.54,65.23 110.54,80.47 104.04,86.97 104.04,95.5 103.02,96.52 X1.1 | 127.81,47.95 131.47,51.61 131.47,69.29 129.64,71.12 SPARES.8 | 91.03,32.31 v94.28,35.56
  Bottom 0.254: RN3.4 76.2,52.22 78.64,52.22 RN3.5 | v110.54,65.23 113.59,62.18 119.89,62.18 119.89,59.74 119.48,59.74 RN2.8 | v94.28,35.56 100.38,41.66 110.34,41.66 114.4,45.72 114.4,46.94 115.42,46.94 C6.1
N$35  (via drill 0.61)
  Top 0.254: v78.03,71.93 77.42,72.54 77.42,77.22 74.37,80.26 74.37,83.72 73.15,84.94 v68.68,84.94 | v66.65,86.97 61.98,91.64 61.98,93.88 59.74,96.11 59.74,96.52 X3.3
  Bottom 0.254: v78.03,71.93 76.81,70.71 76.2,70.71 OPTO1.4 | v68.68,84.94 v66.65,86.97
N$36  (via drill 0.61)
  Top 0.254: v75.39,80.67 79.86,76.2 79.86,73.97 80.47,73.36 80.47,68.28 81.28,67.46 OPTO1.6 | v68.28,86.97 62.59,92.66 62.59,96.32 62.38,96.52 X3.4
  Bottom 0.254: v75.39,80.67 73.76,82.3 72.95,82.3 v68.28,86.97
N$37  (via drill 0.61)
  Top 0.254: v62.79,66.04 62.79,57.3 53.65,57.3 47.14,50.8 RN1.6
  Bottom 0.254: v62.79,66.04 67.87,71.12 75.79,71.12 77.62,72.95 77.62,74.78 78.64,74.78 OPTO1.12
N$38
  Top 0.254: +5V.A 22.96,5.08 24.18,3.86 66.04,3.86 66.04,8.53 68.48,10.97 68.48,14.22 67.46,15.24 R11.2
N$39  (via drill 0.61)
  Top 0.254: v37.39,76.61 37.39,76.81 33.93,76.81 27.64,70.51 27.64,40.23 22.96,35.56 RFAN.A
  Bottom 0.254: v37.39,76.61 39.01,78.23 68.07,78.23 68.48,78.64 84.33,78.64 85.75,77.22 85.75,74.98 86.36,74.98 OPTO1.9
N$40  (via drill 0.61)
  Top 0.254: v84.94,44.91 88.19,48.16 88.19,63.2 84.94,66.45 84.94,71.12 81.28,74.78 OPTO1.11
  Bottom 0.254: v84.94,44.91 84.73,45.11 22.96,45.11 22.96,43.28 WGAT.A
N$41  (via drill 0.61)
  Top 0.254: v84.94,48.36 87.58,51 87.58,58.32 86.36,59.54 RN3.9
  Bottom 0.254: v84.94,48.36 71.53,48.36 69.49,46.33 41.66,46.33 35.36,52.63 22.96,52.63 22.96,50.8 ASD.A
N$42  (via drill 0.61)
  Top 0.254: v68.89,77.62 63.8,72.54 63.8,54.66 53.44,54.66 47.14,48.36 RN1.7
  Bottom 0.254: v68.89,77.62 69.09,77.42 84.33,77.42 84.33,74.98 83.92,74.98 OPTO1.10
N$43  (via drill 0.61)
  Top 0.254: v36.98,70.71 32.72,70.71 28.25,66.24 28.25,33.33 BARO.A
  Bottom 0.254: v36.98,70.71 38,71.73 75.59,71.73 76.4,72.54 76.4,74.78 76.2,74.78 OPTO1.13
N$44  (via drill 0.61)
  Top 0.254: v79.86,61.57 79.86,58.52 77.62,56.29 77.62,50.19 70.51,50.19 68.68,52.02 RN3.1 | v113.79,69.9 114.2,70.31 114.2,76.61 113.18,77.62 113.18,79.86 114.4,81.08 114.4,81.69 118.06,85.34 118.06,96.52 X1.7
  Bottom 0.254: v79.86,61.57 81.48,63.2 100.79,63.2 103.02,65.43 103.02,69.9 v113.79,69.9
N$45  (via drill 0.61)
  Top 0.254: v40.64,58.52 31.9,67.26 2N4402.E
  Bottom 0.254: v40.64,58.52 43.28,55.88 RN1.4
N$46
  Bottom 0.254: COIL-.A 22.96,66.04 22.96,69.9 35.56,69.9 35.97,69.49 35.97,68.28 36.17,68.28 36.98,67.46 2N4402.C
N$47
  Top 0.254: FT.19 53.44,89.2 36.98,89.2 36.98,89.41 31.29,95.1 29.26,95.1 R2.2 29.06,95.3 29.06,95.5 28.04,96.52 R1.2
N$48  (via drill 0.61)
  Top 0.254: v52.63,97.33 52.63,95.71 54.66,93.67 54.66,91.24 53.65,91.24 FT.16 | v50.6,99.36 47.55,99.36 46.94,99.97 13.41,99.97 v13.41,96.52 | v13.41,94.49 11.18,94.49 10.97,94.69 9.96,94.69 USB.2
  Bottom 0.254: v50.6,99.36 v52.63,97.33 | v13.41,94.49 v13.41,96.52
N$49  (via drill 0.61)
  Top 0.254: v96.11,24.18 88.8,16.87 88.8,3.25 22.96,3.25 21.74,4.47 21.74,19.3 22.76,20.32 +12V.A | v100.38,28.45 113.59,28.45 113.59,56.69 115.62,58.73 115.62,63.6 119.28,67.26 RN2.9
  Bottom 0.254: v96.11,24.18 v100.38,28.45
N$50
  Top 0.254: R31.2 54.66,7.72 65.43,7.72 65.43,9.55 R30.1
N$51  (via drill 0.61)
  Top 0.254: v38,11.38 24.18,11.38 +8V.A | v39.42,9.96 54.46,9.96 54.46,11.38 R30.2
  Bottom 0.254: v38,11.38 v39.42,9.96
N$52  (via drill 0.61)
  Top 0.254: v77.42,20.32 59.74,20.32 54.66,15.24 R11.1 | v79.45,20.32 86.36,20.32 94.28,28.25 95.3,28.25 95.3,40.84 98.75,44.3 98.75,76.4 v96.93,78.23 | v99.97,82.3 101.4,83.72 101.4,97.94 102.21,98.75 110.34,98.75 110.34,96.52 X1.4
  Bottom 0.254: v77.42,20.32 v79.45,20.32 | v96.93,78.23 96.93,79.45 97.13,79.45 v99.97,82.3
N$53  (via drill 0.61)
  Top 0.254: v40.23,56.49 46.94,63.2 46.94,63.4 RN1.1
  Bottom 0.254: v40.23,56.49 38.81,55.07 37.39,55.07 36.98,54.66 T7.1
N$54  (via drill 0.61)
  Top 0.254: v65.43,52.22 53.65,52.22 42.47,41.05 42.47,24.18 39.42,24.18 IC1.5 | v100.38,51.41 103.02,54.05 103.02,60.96 103.63,61.57 105.46,61.57 105.46,58.52 106.27,57.71 109.12,57.71 109.12,59.54 RN2.4
  Bottom 0.254: v65.43,52.22 67.87,54.66 74.17,54.66 74.37,54.46 87.58,54.46 90.63,51.41 92.25,51.41 92.66,51.82 95.3,51.82 95.71,51.41 v100.38,51.41
N$55  (via drill 0.61)
  Top 0.254: v72.14,43.28 66.65,48.77 66.65,49.38 53.44,49.38 43.08,39.01 43.08,21.74 39.42,21.74 IC1.6 | v100.38,44.5 104.04,48.16 104.04,59.54 RN2.2
  Bottom 0.254: v72.14,43.28 76.4,39.01 94.89,39.01 v100.38,44.5
N$56
  Top 0.254: IC1.8 47.14,19.1 53.24,25.2 53.24,25.4 R18.1
N$57  (via drill 0.61)
  Top 0.254: R18.2 80.26,39.62 v80.26,40.03 | v87.99,40.03 91.03,43.08 91.03,48.56 95.3,52.83 95.3,72.95 v97.74,75.39
  Bottom 0.254: v80.26,40.03 v87.99,40.03 | v97.74,75.39 100.38,78.03 114.2,78.03 T5.2
N$58  (via drill 0.61)
  Top 0.254: v112.78,73.56 112.78,69.49 112.98,69.29 112.98,60.96 114.2,59.74 RN2.6
  Bottom 0.254: 113.59,74.37 v112.78,73.56 | 113.59,74.37 113.79,74.37 114.4,74.98 114.4,75.59 115.21,75.59 115.42,75.79 115.42,76.2 T5.1 | 113.59,74.37 90.83,74.37 90.83,79.45 89.2,81.08 89,81.08 89,96.52 X2.5
N$59  (via drill 0.61)
  Top 0.254: v50.6,2.23 129.44,2.23 131.67,4.47 131.67,20.93 130.66,21.95 P1.P$4
  Bottom 0.254: v50.6,2.23 39.62,13.21 39.62,18.9 39.42,18.9 IC1.7
N$60
  Top 0.254: IC1.13 45.11,29.87 45.11,20.52 44.5,19.91 44.5,14.02 JP1.2
N$61
  Bottom 0.254: T7.3 34.14,54.66 33.73,55.07 25.4,55.07 23.77,56.69 23.77,58.32 22.96,58.32 CEL.A
N$62
  Top 0.254: FT.15 53.44,91.85 47.35,97.94 47.35,98.75 46.74,99.36 16.46,99.36 16.46,95.91 14.02,93.47 12.8,93.47 12.39,93.88 9.96,93.88 USB.3
N$63
  Top 0.254: R1.1 15.24,95.5 9.96,95.5 USB.1
N$64  (via drill 0.61)
  Top 0.254: v49.38,61.77 49.17,61.98 49.17,87.17 48.56,87.78 36.37,87.78 36.17,87.58 33.12,87.58 33.12,88.8 RXLED.A
  Bottom 0.254: v49.38,61.77 52.22,58.93 54.05,58.93 54.46,58.52 RN1.12
N$65
  Top 0.254: C10.1 45.72,90.63 53.44,90.63 FT.17
N$66  (via drill 0.61)
  Top 0.254: v55.07,86.56 55.07,87.38 53.65,87.38 FT.22 | v48.16,86.77 25.4,86.77 TXLED.K
  Bottom 0.254: v55.07,86.56 54.86,86.77 v48.16,86.77
N$67
  Top 0.254: FT.23 53.44,86.56 49.78,86.56 49.78,87.38 48.56,88.59 35.56,88.59 RXLED.K
N$68  (via drill 0.61)
  Top 0.254: v70.71,46.13 66.85,49.99 66.85,50.8 RN1.9
  Bottom 0.254: v70.71,46.13 70.92,45.92 87.58,45.92 91.85,41.66 96.11,41.66 103.63,49.17 103.63,51.41 106.27,51.41 110.34,55.47 129.03,55.47 129.44,55.88 SPARES.14
N$69
  Top 0.254: 21V.5 117.45,10.36 117.04,10.77 117.04,15.04 L1.1 D1.A
N$70  (via drill 0.61)
  Top 0.254: 101.6,18.9 D1.C | 101.6,18.9 101.6,12.6 109.12,5.08 R8.2 | 101.6,18.9 93.88,18.9 90.22,15.24 C13.1 | v123.34,69.7 123.34,96.52 X1.9 | v123.34,67.67 128.22,62.79 128.22,54.66 SPARES.15
  Bottom 0.254: v123.34,67.67 v123.34,69.7 | D1.C 102.62,21.34 110.54,21.34 128.63,39.42 128.63,52.83 129.03,52.83 SPARES.15
N$71
  Top 0.254: 116.23,6.5 118.67,6.5 119.48,5.69 125.98,5.69 BOOTSTRAP.P$2 | 116.23,6.5 116.23,5.08 21V.3 | 116.23,6.5 112.98,6.5 109.32,10.16 R7.2
N$72
  Top 0.254: 21V.2 114.4,4.47 114.4,3.66 114,3.25 96.52,3.25 R8.1 R10.2
N$73
  Top 0.254: 21V.1 113.59,4.88 110.34,4.88 110.34,4.47 109.73,3.86 97.74,3.86 97.74,5.49 93.07,10.16 R14.2
N$74
  Top 0.254: R14.1 80.06,10.16 90.02,20.12 90.02,21.54 C14.1
N$75
  Top 0.254: 72.34,91.44 72.34,96.52 X3.8 | 72.34,91.44 72.34,85.95 60.96,85.95 FT.5 | 72.34,91.44 JP2.1
N$76  (via drill 0.61)
  Top 0.254: v26.62,61.77 21.54,61.77 21.54,91.85 28.04,98.35 v46.33,98.35 | v48.36,98.35 53.65,98.35 54.66,99.36 120.5,99.36 120.5,96.52 X1.8
  Bottom 0.254: v26.62,61.77 35.56,61.77 T6.2 | v46.33,98.35 v48.36,98.35
N$77  (via drill 0.61)
  Top 0.254: v39.62,49.78 38,51.41 38,55.88 34.34,59.54 T6.3
  Bottom 0.254: v39.62,49.78 44.09,49.78 44.3,49.58 R9.2
N$78
  Top 0.254: R9.1 31.9,49.58 35.56,53.24 T7.2
N$79
  Top 0.254: VCC.A 33.12,5.08 40.03,11.99 53.44,11.99 53.44,23.77 54.46,24.79 54.46,48.16 RN1.8
N$80
  Top 0.254: RN1.5 47.14,53.44 53.44,59.74 58.52,59.74 58.52,79.65 61.16,82.3 73.56,82.3 73.56,74.98 OPTO1.14
N$81  (via drill 0.61)
  Top 0.254: v44.3,63.8 39.62,68.48 39.62,78.23 31.7,86.16 22.96,86.16 22.96,88.8 TXLED.A
  Bottom 0.254: v44.3,63.8 44.7,64.21 45.31,64.21 45.31,64.41 45.52,64.41 45.52,64.62 49.17,64.62 52.22,61.57 53.85,61.57 54.46,60.96 RN1.13
N$82  (via drill 0.61)
  Top 0.254: v94.28,29.26 90.83,29.26 83.31,36.78 83.31,43.69 74.57,43.69 67.46,50.8 67.46,53.24 54.66,53.24 RN1.10 | v98.35,29.06 101.4,26.01 114.2,26.01 114.2,54.66 118.26,58.73 118.26,60.96 118.87,61.57 127.61,61.57 127.61,53.24 128.83,52.02 130.86,52.02 130.86,57.1 SPARES.13
  Bottom 0.254: v94.28,29.26 94.28,29.06 v98.35,29.06
N$83
  Bottom 0.254: RN1.11 54.66,55.88 55.07,55.47 74.17,55.47 74.57,55.07 90.42,55.07 91.44,56.08 122.94,56.08 127.61,60.76 129.24,60.76 129.44,60.96 SPARES.12
N$84
  Bottom 0.254: 105.46,32.11 105.46,31.9 L7808CV.IN 105.46,32.11 | 105.46,32.11 105.46,32.31 106.07,32.92 106.27,32.92 106.27,34.14 113.59,41.45 124.77,41.45 125.17,41.86 SMECON.2 | C2.1 81.28,34.95 84.33,34.95 85.75,33.53 89.61,33.53 90.63,34.54 101.19,34.54 103.63,32.11 105.46,32.11
N$85
  Top 0.254: SMECON.1 125.37,44.3 129.44,44.3 129.44,43.89 131.27,42.06 SMECON.5
SPARE1
  Top 0.254: X1.10 125.78,96.52 126.8,95.5 126.8,91.64 SPARES.1
SPARE2
  Top 0.254: X1.11 128.42,96.52 129.44,95.5 129.44,91.03 130.86,89.61 130.86,87.58 129.64,86.36 SPARES.2
SPARE3
  Top 0.254: X1.12 130.86,96.52 131.47,95.91 131.47,85.75 SPARES.3
SPARE4  (via drill 0.61)
  Top 0.254: X2.6 92.66,95.3 92.66,93.27 v93.47,92.46
  Bottom 0.254: v93.47,92.46 93.67,92.25 116.84,92.25 127.61,81.48 129.24,81.48 129.44,81.28 SPARES.4
SPARE5  (via drill 0.61)
  Top 0.254: v94.49,91.24 94.49,96.11 94.08,96.52 X2.7
  Bottom 0.254: v94.49,91.24 94.69,91.44 115.82,91.44 127.81,79.45 129.03,79.45 129.64,78.84 SPARES.5
SPARE6  (via drill 0.61)
  Top 0.254: v53.24,99.36 53.85,99.36 54.46,99.97 132.28,99.97 132.28,78.84 129.64,76.2 SPARES.6
  Bottom 0.254: v53.24,99.36 67.26,99.36 67.26,96.52 X3.6
SPARE7  (via drill 0.61)
  Top 0.254: v100.38,90.42 100.38,98.75 71.73,98.75 70.92,97.94 70.92,97.54 69.9,96.52 X3.7
  Bottom 0.254: v100.38,90.42 100.58,90.63 115.82,90.63 127.41,79.05 127.41,73.76 129.44,73.76 SPARES.7
VCC  (via drill 0.61)
  Top 0.254: BOOTSTRAP.P$4 130.45,5.69 127.2,8.94 118.26,8.94 118.06,8.74 116.23,8.74 116.23,10.16 21V.6 116.03,10.36 115.62,10.77 115.62,15.24 114.2,15.24 | 104.24,15.24 114.2,15.24 | 114.2,15.24 114.2,21.13 114.81,21.74 114.81,37.39 115.42,38 C7.1 | 104.24,15.24 104.24,21.54 97.33,28.45 97.33,30.89 96.52,31.7 L7805CV.OUT 96.52,31.9 99.36,34.75 99.36,52.43 100.18,53.24 C12.1 | 104.24,15.24 L1.2 | 14.43,45.52 14.43,34.54 15.85,33.12 MPH.P$1 | 14.43,45.52 15.85,46.94 TPS.P$1 | 14.43,59.54 15.85,60.96 MAP.P$1 | 14.43,45.52 14.43,59.54 | 14.43,59.54 14.43,73.36 15.85,74.78 RPM.P$1 | v51.82,88.19 51.82,88.59 53.44,88.59 FT.20 | v58.12,87.58 59.54,86.16 59.54,85.75 59.94,85.34 60.76,85.34 FT.4 | IC1.1 40.64,35.56 C1.1 40.64,50.19 39.22,51.61 39.22,54.05 | 39.22,54.05 39.22,57.3 T6.1 | 39.22,54.05 41.66,56.49 41.66,57.1 48.16,57.1 54.46,63.4 RN1.14 54.66,63.6 56.08,65.02 56.08,65.43 | 56.08,65.43 v56.08,87.78 | 56.08,65.43 v57.51,65.43 | v91.44,64.21 C11.1
  Bottom 0.254: C11.1 91.44,53.44 91.85,53.85 94.28,53.85 95.71,55.27 97.33,55.27 98.55,54.05 98.55,53.44 100.18,53.44 C12.1 | v51.82,88.19 52.43,87.58 56.08,87.58 | 56.08,87.58 v58.12,87.58 | v56.08,87.78 56.08,87.58 | MAP.P$1 16.05,60.96 16.46,60.55 30.89,60.55 32.92,58.52 36.37,58.52 36.37,59.54 36.78,59.54 T6.1 | v91.44,64.21 91.03,64.62 62.79,64.62 61.98,65.43 v57.51,65.43